# EAGLE design development board (EAGLE 6.3)
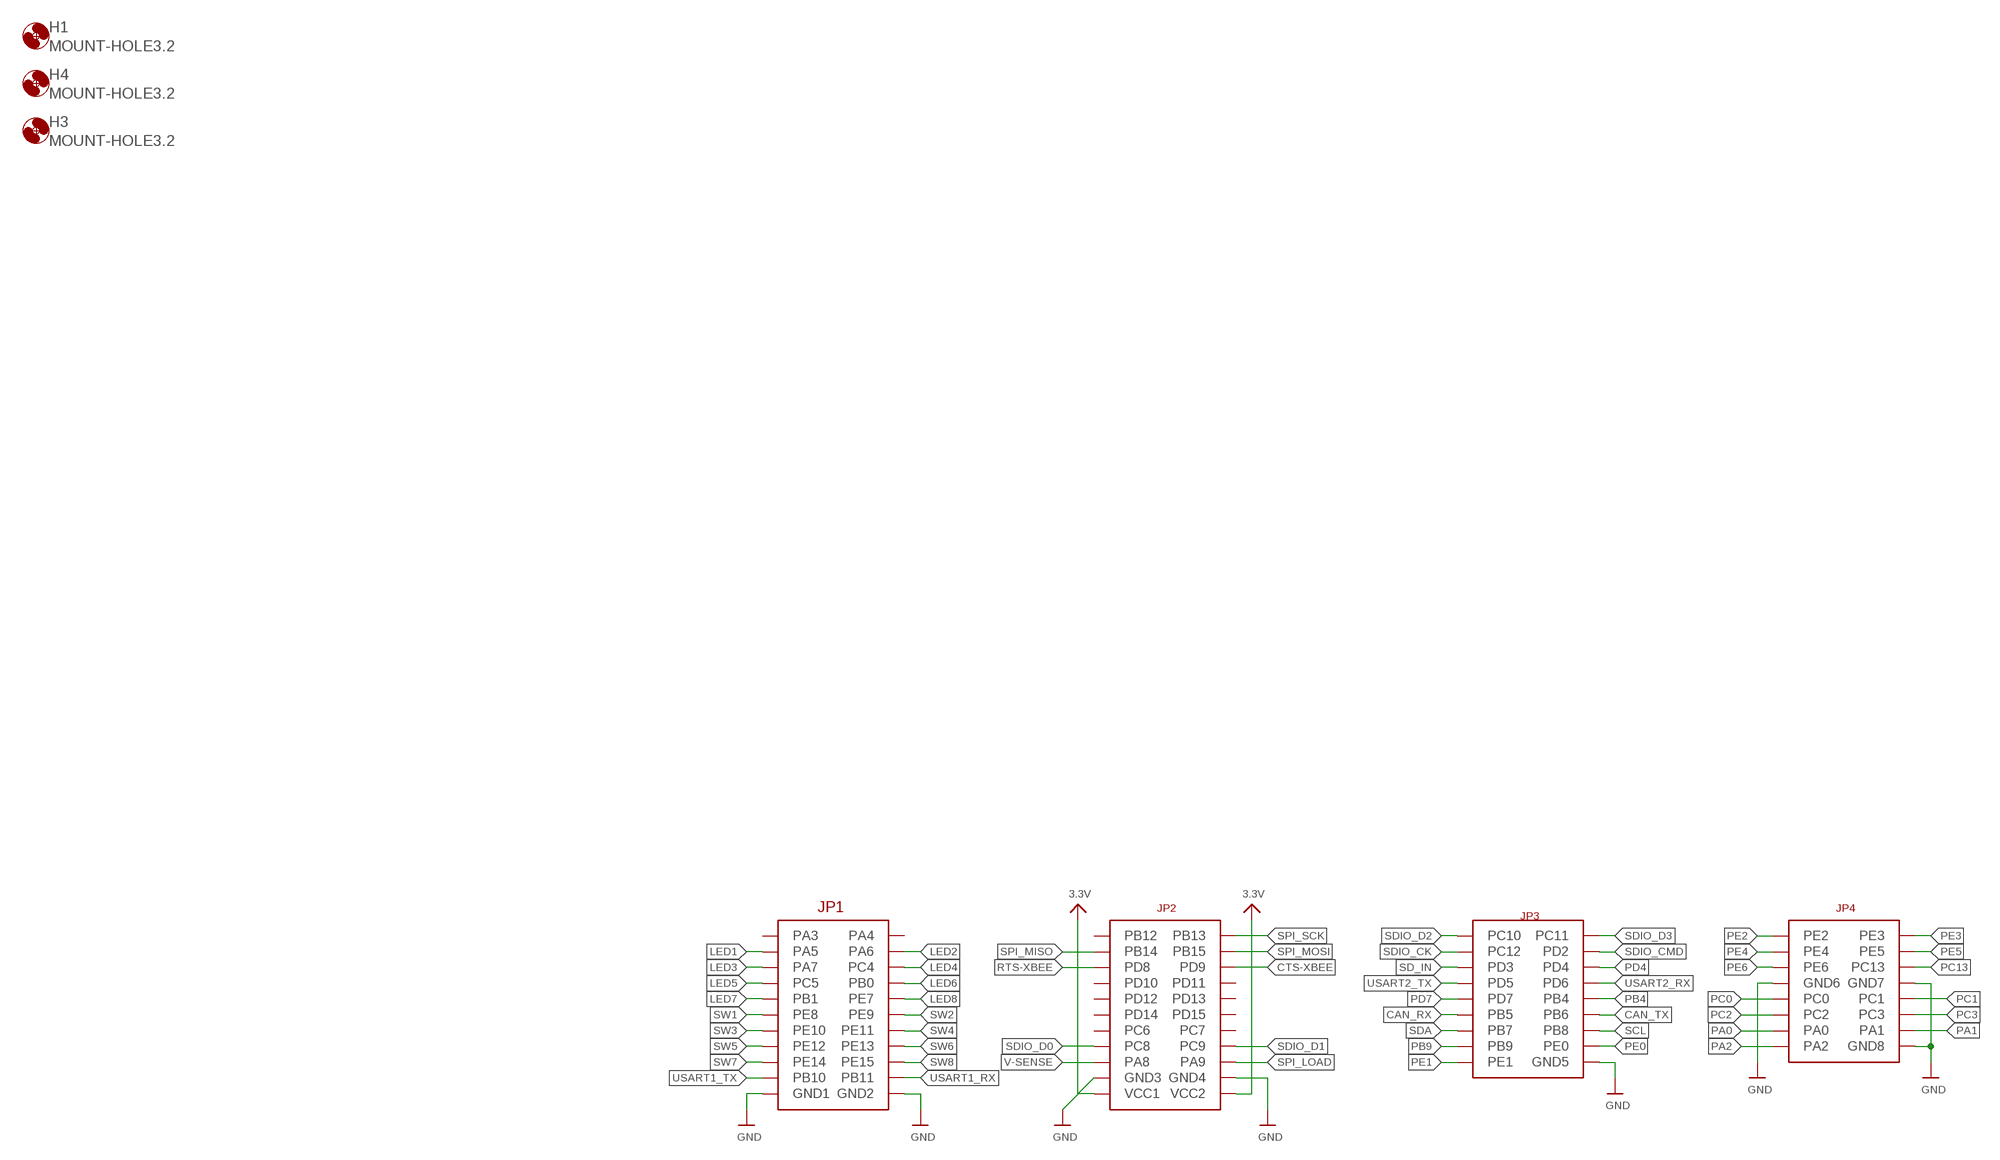
[diagram p0: schematic, sheet 1, part 1 of 3]
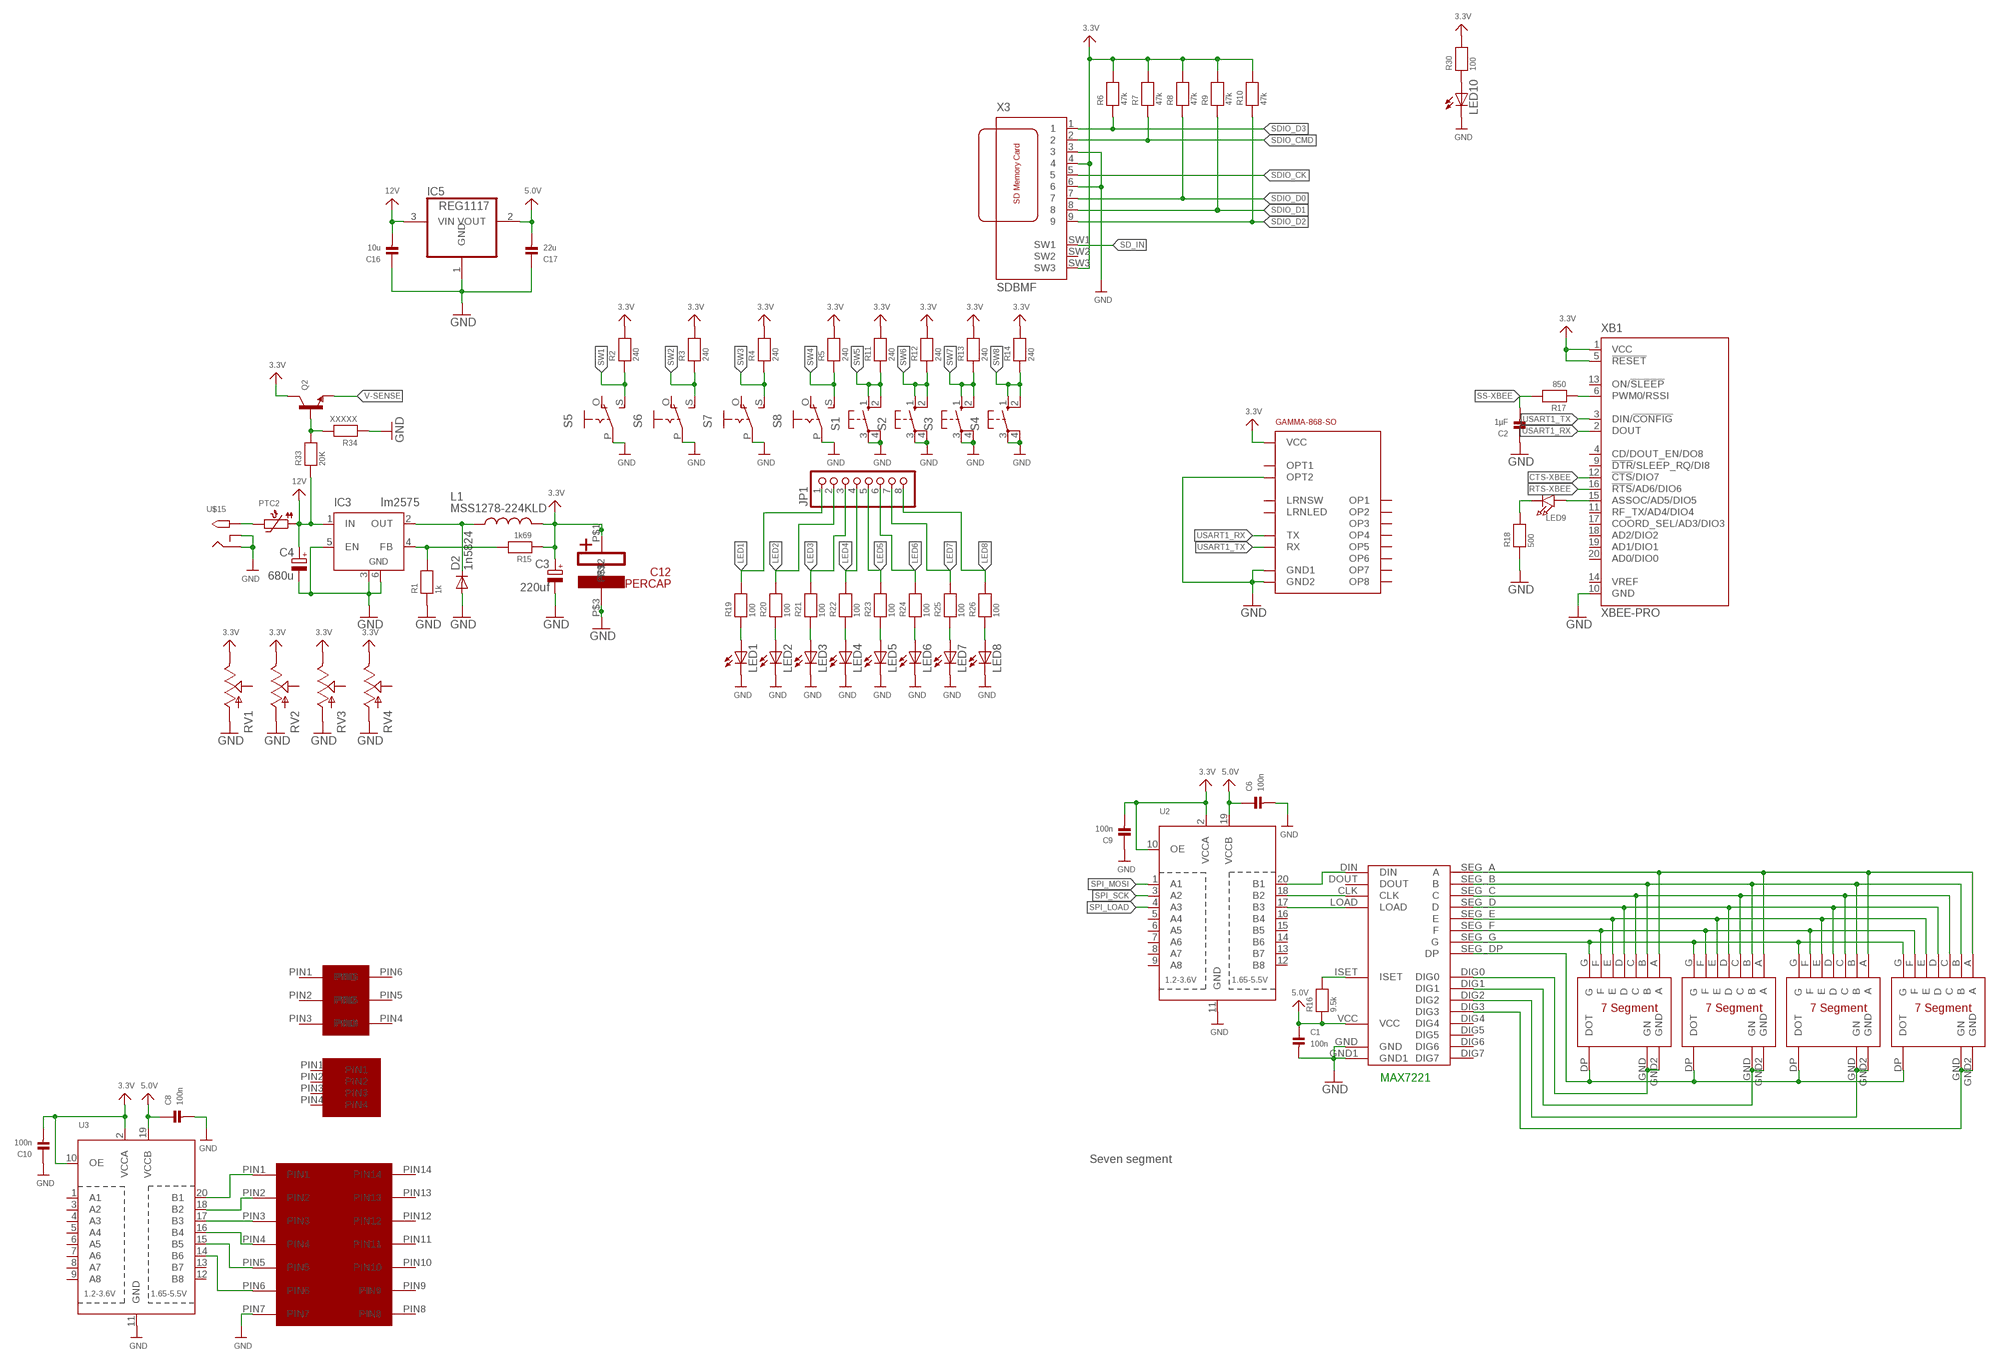
[diagram p1: schematic, sheet 1, part 2 of 3]
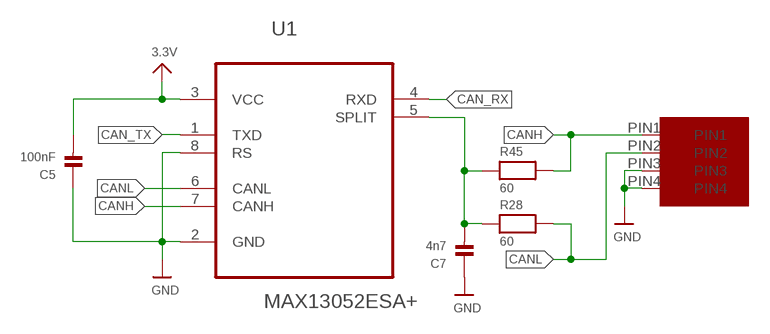
[diagram p2: schematic, sheet 1, part 3 of 3]

## Parts
C1  100n  CAP_CERAMIC_0603  [_0603]
C2  1µF  CAP_CERAMIC_0805  [_0805]
C3  220uf  CPOL-EUE3.5-8  [E3,5-8]
C4  680u  CPOL-EUE5-10.5  [E5-10,5]
C5  100nF  CAP_CERAMIC_0603  [_0603]
C6  100n  CAP_CERAMIC_0603  [_0603]
C7  4n7  CAP_CERAMIC_0603  [_0603]
C8  100n  CAP_CERAMIC_0603  [_0603]
C9  100n  CAP_CERAMIC_0603  [_0603]
C10  100n  CAP_CERAMIC_0603  [_0603]
C12  SUPERCAP  [SUPERCAP]
C16  10u  CAP_CERAMIC_0805  [_0805]
C17  22u  CAP_CERAMIC_0805  [_0805]
D2  1n5824  1N5400  [DO201-15]
H1  MOUNT-HOLE3.2  [3,2]
H3  MOUNT-HOLE3.2  [3,2]
H4  MOUNT-HOLE3.2  [3,2]
IC3  lm2575  LM2596S  [TO263-5]
IC5  REG1117  [SOT223]
JP1  PINHD-1X8BIG  [1X08-BIG]
L1  MSS1278-224KLD  INDUCTORPWR  [CDRH125]
LED1  LEDCHIPLED_1206  [CHIPLED_1206]
LED2  LEDCHIPLED_1206  [CHIPLED_1206]
LED3  LEDCHIPLED_1206  [CHIPLED_1206]
LED4  LEDCHIPLED_1206  [CHIPLED_1206]
LED5  LEDCHIPLED_1206  [CHIPLED_1206]
LED6  LEDCHIPLED_1206  [CHIPLED_1206]
LED7  LEDCHIPLED_1206  [CHIPLED_1206]
LED8  LEDCHIPLED_1206  [CHIPLED_1206]
LED9  LED1206  [CHIPLED_1206]
LED10  LEDCHIPLED_1206  [CHIPLED_1206]
MAX7221  MAX7221-SMD  [MAX7221]
PTC2  PTC1812  [PTC1812]
Q2  TRANSISTOR_NPNWIDE  [SOT23-WIDE]
R1  1k  RESISTOR_0603  [_0603]
R2  240  RESISTOR_0603  [_0603]
R3  240  RESISTOR_0603  [_0603]
R4  240  RESISTOR_0603  [_0603]
R5  240  RESISTOR_0603  [_0603]
R6  47k  RESISTOR_0603  [_0603]
R7  47k  RESISTOR_0603  [_0603]
R8  47k  RESISTOR_0603  [_0603]
R9  47k  RESISTOR_0603  [_0603]
R10  47k  RESISTOR_0603  [_0603]
R11  240  RESISTOR_0603  [_0603]
R12  240  RESISTOR_0603  [_0603]
R13  240  RESISTOR_0603  [_0603]
R14  240  RESISTOR_0603  [_0603]
R15  1k69  RESISTOR_0603  [_0603]
R16  9.5k  RESISTOR_0603  [_0603]
R17  850  RESISTOR_0603  [_0603]
R18  500  RESISTOR_0603  [_0603]
R19  100  RESISTOR_0603  [_0603]
R20  100  RESISTOR_0603  [_0603]
R21  100  RESISTOR_0603  [_0603]
R22  100  RESISTOR_0603  [_0603]
R23  100  RESISTOR_0603  [_0603]
R24  100  RESISTOR_0603  [_0603]
R25  100  RESISTOR_0603  [_0603]
R26  100  RESISTOR_0603  [_0603]
R28  60  RESISTOR_0603  [_0603]
R30  100  RESISTOR_0603  [_0603]
R33  20K  RESISTOR_0603  [_0603]
R34  XXXXX  RESISTOR_0603  [_0603]
R45  60  RESISTOR_0603  [_0603]
RV1  POT  [ALPS_POT]
RV2  POT  [ALPS_POT]
RV3  POT  [ALPS_POT]
RV4  POT  [ALPS_POT]
S1  10-XX  [B3F-10XX]
S2  10-XX  [B3F-10XX]
S3  10-XX  [B3F-10XX]
S4  10-XX  [B3F-10XX]
S5  EG1218S  [EG1218]
S6  EG1218S  [EG1218]
S7  EG1218S  [EG1218]
S8  EG1218S  [EG1218]
U1  MAX13052ESA+  [SOIC127P600X175-8N]
U2  TXB0108PWR  [TSSOP20]
U3  TXB0108PWR  [TSSOP20]
U$1  CPU-BOARD  [CPU-BOARD-JP1]
U$2  GAMMA-868-SO  [UNICORN_V2_GAMMA-868-SO]
U$15  2.1MMJACKSMT  [DCJACK_2MM_SMT]
U$23  REDSEVENSEGMENT  [REDSEGMENT]
U$24  REDSEVENSEGMENT  [REDSEGMENT]
U$25  REDSEVENSEGMENT  [REDSEGMENT]
U$26  REDSEVENSEGMENT  [REDSEGMENT]
U$57  MICROFIT4  [MICROFIT4SOCK]
U$61  MICROFIT14  [MICROFIT14SOCK]
U$67  MICROFIT4  [MICROFIT4SOCK]
U$68  MICROFIT6  [MICROFIT6SOCK]
X3  SDBMF  [SDBMF-009XXBXX2]
XB1  XBEE-PRO  [XBEE-PRO]

## Nets
3.3V: C3.+ C5.2 C9.2 C10.2 C12.P$1 L1.2 Q2.3(C) R2.2 R3.2 R4.2 R5.2 R6.2 R7.2 R8.2 R9.2 R10.2 R11.2 R12.2 R13.2 R14.2 R15.1 R30.2 RV1.P$1(E) RV2.P$1(E) RV3.P$1(E) RV4.P$1(E) U1.3(VCC) U2.2(VCCA) U2.10(OE) U3.2(VCCA) U3.10(OE) U$1.P$43(VCC1) U$1.P$44(VCC2) U$2.P$16(VCC) X3.4 X3.SW3 XB1.1(VCC) XB1.5(!RESET)
5.0V: C1.1 C6.1 C8.1 C17.2 IC5.2(VOUT) MAX7221.VCC R16.1 U2.19(VCCB) U3.19(VCCB)
12V: C4.+ C16.2 IC3.1(IN) IC5.3(VIN) PTC2.P$1 R33.1
CAN_RX: U1.4(RXD) U$1.P$55(PB5)
CAN_TX: U1.1(TXD) U$1.P$56(PB6)
CANH: R45.2 U1.7(CANH) U$57.PIN1
CANL: R28.2 U1.6(CANL) U$57.PIN2
CTS-XBEE: U$1.P$28(PD9) XB1.12(!CTS!/DIO7)
DIG0: MAX7221.DIG0 U$23.GND2(GND) U$23.GND(GN)
DIG1: MAX7221.DIG1 U$24.GND2(GND) U$24.GND(GN)
DIG2: MAX7221.DIG2 U$25.GND2(GND) U$25.GND(GN)
DIG3: MAX7221.DIG3 U$26.GND2(GND) U$26.GND(GN)
GND: C1.2 C2.1 C3.- C4.- C5.1 C6.2 C7.1 C8.2 C9.1 C10.1 C12.P$3 C16.1 C17.1 D2.A IC3.3(GND) IC3.5(EN) IC3.6(GND) IC5.1(GND) LED1.C LED2.C LED3.C LED4.C LED5.C LED6.C LED7.C LED8.C LED10.C MAX7221.GND MAX7221.GND1 R1.1 R18.1 R34.1 RV1.P$3(A) RV2.P$3(A) RV3.P$3(A) RV4.P$3(A) S1.3(P) S1.4(P1) S2.3(P) S2.4(P1) S3.3(P) S3.4(P1) S4.3(P) S4.4(P1) S5.P S6.P S7.P S8.P U1.2(GND) U1.8(RS) U2.11(GND) U3.11(GND) U$1.P$19(GND1) U$1.P$20(GND2) U$1.P$41(GND3) U$1.P$42(GND4) U$1.P$62(GND5) U$1.P$69(GND6) U$1.P$70(GND7) U$1.P$78(GND8) U$2.P$2(GND1) U$2.P$14(OPT2) U$2.P$15(GND2) U$15.GND(RING) U$15.GNDBREAK(RING_SW) U$57.PIN3 U$57.PIN4 U$61.PIN7 X3.3 X3.6 XB1.10(GND)
LED1: JP1.1 R19.2 U$1.P$3(PA5)
LED2: JP1.2 R20.2 U$1.P$4(PA6)
LED3: JP1.3 R21.2 U$1.P$5(PA7)
LED4: JP1.4 R22.2 U$1.P$6(PC4)
LED5: JP1.5 R23.2 U$1.P$7(PC5)
LED6: JP1.6 R24.2 U$1.P$8(PB0)
LED7: JP1.7 R25.2 U$1.P$9(PB1)
LED8: JP1.8 R26.2 U$1.P$10(PE7)
N$1: PTC2.P$2 U$15.PWR2(TIP)
N$2: R17.1 XB1.6(PWM0/RSSI)
N$3: U3.17(B3) U$61.PIN3
N$4: U3.16(B4) U$61.PIN4
N$5: LED9.A XB1.15(ASSOC/AD5/DIO5)
N$6: LED9.C R18.2
N$7: Q2.1(B) R33.2 R34.2
N$8: U3.18(B2) U$61.PIN2
N$9: U3.20(B1) U$61.PIN1
N$10: U3.15(B5) U$61.PIN5
N$11: U3.14(B6) U$61.PIN6
N$18: MAX7221.SEG_A(A) U$23.A U$24.A U$25.A U$26.A
N$19: IC3.4(FB) R1.2 R15.2
N$20: LED10.A R30.1
N$21: D2.C IC3.2(OUT) L1.1
N$23: MAX7221.SEG_B(B) U$23.B U$24.B U$25.B U$26.B
N$24: MAX7221.SEG_C(C) U$23.C U$24.C U$25.C U$26.C
N$25: MAX7221.SEG_D(D) U$23.D U$24.D U$25.D U$26.D
N$26: MAX7221.SEG_E(E) U$23.E U$24.E U$25.E U$26.E
N$27: MAX7221.SEG_F(F) U$23.F U$24.F U$25.F U$26.F
N$28: MAX7221.SEG_G(G) U$23.G U$24.G U$25.G U$26.G
N$30: LED1.A R19.1
N$32: LED2.A R20.1
N$34: LED3.A R21.1
N$36: LED4.A R22.1
N$38: LED5.A R23.1
N$40: LED6.A R24.1
N$42: LED7.A R25.1
N$44: LED8.A R26.1
N$54: MAX7221.SEG_DP(DP) U$23.DP(DOT) U$24.DP(DOT) U$25.DP(DOT) U$26.DP(DOT)
N$55: MAX7221.ISET R16.2
N$56: MAX7221.CLK U2.18(B2)
N$57: MAX7221.LOAD U2.17(B3)
N$58: MAX7221.DIN U2.20(B1)
N$72: C7.2 R28.1 R45.1 U1.5(SPLIT)
PA0: U$1.P$75(PA0)
PA1: U$1.P$76(PA1)
PA2: U$1.P$77(PA2)
PB4: U$1.P$54(PB4)
PB9: U$1.P$59(PB9)
PC0: U$1.P$71(PC0)
PC1: U$1.P$72(PC1)
PC2: U$1.P$73(PC2)
PC3: U$1.P$74(PC3)
PC13: U$1.P$68(PC13)
PD4: U$1.P$50(PD4)
PD7: U$1.P$53(PD7)
PE0: U$1.P$60(PE0)
PE1: U$1.P$61(PE1)
PE2: U$1.P$63(PE2)
PE3: U$1.P$64(PE3)
PE4: U$1.P$65(PE4)
PE5: U$1.P$66(PE5)
PE6: U$1.P$67(PE6)
RTS-XBEE: U$1.P$27(PD8) XB1.16(!RTS!/AD6/DIO6)
SCL: U$1.P$58(PB8)
SD_IN: U$1.P$49(PD3) X3.SW1
SDA: U$1.P$57(PB7)
SDIO_CK: U$1.P$47(PC12) X3.5
SDIO_CMD: R7.1 U$1.P$48(PD2) X3.2
SDIO_D0: R8.1 U$1.P$37(PC8) X3.7
SDIO_D1: R9.1 U$1.P$38(PC9) X3.8
SDIO_D2: R10.1 U$1.P$45(PC10) X3.9
SDIO_D3: R6.1 U$1.P$46(PC11) X3.1
SPI_LOAD: U2.4(A3) U$1.P$40(PA9)
SPI_MISO: U$1.P$25(PB14)
SPI_MOSI: U2.1(A1) U$1.P$26(PB15)
SPI_SCK: U2.3(A2) U$1.P$24(PB13)
SS-XBEE: C2.2 R17.2
SW1: R2.1 S5.S U$1.P$11(PE8)
SW2: R3.1 S6.S U$1.P$12(PE9)
SW3: R4.1 S7.S U$1.P$13(PE10)
SW4: R5.1 S8.S U$1.P$14(PE11)
SW5: R11.1 S1.1(S) S1.2(S1) U$1.P$15(PE12)
SW6: R12.1 S2.1(S) S2.2(S1) U$1.P$16(PE13)
SW7: R13.1 S3.1(S) S3.2(S1) U$1.P$17(PE14)
SW8: R14.1 S4.1(S) S4.2(S1) U$1.P$18(PE15)
USART1_RX: U$1.P$22(PB11) U$2.P$17(TX) XB1.2(DOUT)
USART1_TX: U$1.P$21(PB10) U$2.P$18(RX) XB1.3(DIN/!CONFIG)
USART2_RX: U$1.P$52(PD6)
USART2_TX: U$1.P$51(PD5)
V-SENSE: Q2.2(E) U$1.P$39(PA8)
Unconnected: MAX7221.DIG4 MAX7221.DIG5 MAX7221.DIG6 MAX7221.DIG7 MAX7221.DOUT RV1.P$2(S) RV2.P$2(S) RV3.P$2(S) RV4.P$2(S) S5.O S6.O S7.O S8.O U2.5(A4) U2.6(A5) U2.7(A6) U2.8(A7) U2.9(A8) U2.12(B8) U2.13(B7) U2.14(B6) U2.15(B5) U2.16(B4) U3.1(A1) U3.3(A2) U3.4(A3) U3.5(A4) U3.6(A5) U3.7(A6) U3.8(A7) U3.9(A8) U3.12(B8) U3.13(B7) U$1.P$1(PA3) U$1.P$2(PA4) U$1.P$23(PB12) U$1.P$29(PD10) U$1.P$30(PD11) U$1.P$31(PD12) U$1.P$32(PD13) U$1.P$33(PD14) U$1.P$34(PD15) U$1.P$35(PC6) U$1.P$36(PC7) U$2.P$3(OP1) U$2.P$4(OP2) U$2.P$5(LRNSW) U$2.P$6(LRNLED) U$2.P$7(OP3) U$2.P$8(OP4) U$2.P$9(OP5) U$2.P$10(OPT1) U$2.P$11(OP6) U$2.P$12(OP7) U$2.P$13(OP8) U$61.PIN8 U$61.PIN9 U$61.PIN10 U$61.PIN11 U$61.PIN12 U$61.PIN13 U$61.PIN14 U$67.PIN1 U$67.PIN2 U$67.PIN3 U$67.PIN4 U$68.PIN1 U$68.PIN2 U$68.PIN3 U$68.PIN4 U$68.PIN5 U$68.PIN6 X3.SW2 XB1.4(CD/DOUT_EN/DO8) XB1.9(!DTR!/SLEEP_RQ/DI8) XB1.11(RF_TX/AD4/DIO4) XB1.13(ON/!SLEEP) XB1.14(VREF) XB1.17(COORD_SEL/AD3/DIO3) XB1.18(AD2/DIO2) XB1.19(AD1/DIO1) XB1.20(AD0/DIO0)

## Notes on the sheet
- MAX7221
- Seven segment

## Library data of the parts
C1 C2 C5-C10 C16 C17 = microbuilder:CAP_CERAMIC: Ceramic Capacitors 0402 - 0402 Surface Mount Capacitors 16pF 50V 5% [Digikey: 445-4899-2-ND] 18pF 50V 5% [Digikey: 490-1281-2-ND] 22pF 50V 5% [Digikey: 490-1283-2-ND] 68pF 50V 5% [Digikey: 490-1289-2-ND] 0.1uF 10V 10% [Digikey: 490-1318-2-ND] 1.0uF 6.3V 10% [Digikey: 490-1320-2-ND] 0603 - 0603 Surface Mount Capacitors 16 pF 50V 5% [Digikey: 445-5051-2-ND] 22 pF 50V [Digikey: PCC220ACVTR-ND] 33 pF 50V 5% [Digikey: 490-1415-1-ND] 56pF 50V 5% [Digikey: 490-1421-1-ND] 220pF 50V 5% [Digikey: 445-1285-1-ND] 680 pF 50V 2200 pF 50V 5% C0G [Digikey: 445-1297-1-ND] 5600 pF 100V 5% X7R [Digikey: 478-3711-1-ND] 0.1 µF 25V 10% [Digikey: PCC2277TR-ND] 0.22 µF 16V 10% X7R [Digikey: 445-1318-1-ND] 1.0 µF 25V 10% [Digikey: 445-5146-2-ND] 0603 - RF Specific 3pF 250V +/-0.1pF RF [Digikey: 712-1347-1-ND] 18 pF 250V 5% [Digikey: 478-3505-1-ND or 712-1322-1-ND] 56 pF 250V 5% C0G RF [Digikey: 490-4867-1-ND] 68 pF 250V RF [Digikey: 490-4868-1-ND] 0805 - 0805 Surface Mount Capacitors 220 pF 250V 2% RF Ceramic Capacitor [Digikey: 712-1398-1-ND] 1000 pF 50V 2% NP0 Ceramic Capacitor [Digikey: 478-3760-1-ND] 0.1 µF 25V 10% Ceramic Capacitor [Digikey: PCC1828TR-ND] 1.0 µF 16V 10% Ceramic Capacitor[Digikey: 490-1691-2-ND] 10.0 µF 10V 10% Ceramic Capacitor[Digikey: 709-1228-1-ND] 10.0 uF 16V 10% Ceramic Capacitor [Digikey: 478-5165-2-ND] 47 uF 6.3V 20% Ceramic Capacitor [Digikey: 587-1779-1-ND or 399-5506-1-ND] 1206 - 1206 Surface Mount Capacitors 47uF 10V 20% Ceramic Capacitor [Digikey: 490-5528-1-ND or 399-5508-1-ND or 445-6010-1-ND] 100uF 6.3V -20%, +80% Y5V Ceramic Capacitor (Digikey: 490-4512-1-ND, Mouser: 81-GRM31CF50J107ZE1L)
C3 C4 = rcl:CPOL-EU: POLARIZED CAPACITOR, European symbol
C12 = unicorn_v2:SUPERCAP
D2 = diode:1N5400: DIODE standard rectifier, 3 A, 50 V (Motorola)
H1 H3 H4 = holes:MOUNT-HOLE: MOUNTING HOLE with drill center marker
IC3 = linear:LM2596S: STEP-DOWN VOLTAGE REGULATOR
IC5 = burr-brown:REG1117: 800mA and 1A Low Dropout (LDO) Positive Regulator 1.8V, 2.5V, 2.85V, 3.3V, 5V, and Adj; MPN: REG1117; OC_FARNELL: 1097566; OC_NEWARK: 14P6981
JP1 = adafruit:PINHD-1X8: PIN HEADER
L1 = SparkFun-Passives:INDUCTOR: Inductors Basic Inductor/Choke - 0603 and 1206. Footprints are not proven and vary greatly between part numbers. INDUCTOR POWER 3.3UH 4.0A SMD 0.197" L x 0.197" W x 0.177" H (5.00mm x 5.00mm x 4.50mm)
LED1-LED8 LED10 = adafruit:LED: LED
LED9 = microbuilder:LED: LED
MAX7221 = max7221-smd:MAX7221-SMD
PTC2 = microbuilder:PTC: PTC (Resettable Fuse) 1206 Package 250mA PTC (16V Max, Time-to-Trip: 0.08s) - Digikey: F2110CT-ND 1210 Package 100mA PTC (30V Max, Time-to-Trip: 0.6s) - Digikey: MF-USMF010-2CT-ND 1812 Package 750mA PTC (24V Max, Time-to-Trip: 0.2s) - Digikey: MF-MSMF075/24-2CT-ND
Q2 = microbuilder:TRANSISTOR_NPN: NPN Transistor Transistor (NPN) 500mA 45V - BC817 [Digikey: 568-1631-1-ND] Transistor (NPN) 500mA 45V - BC817,215 [Mouser: 771-BC817-T/R] SOT23-R - SOT23 footprint optimised for use with solder paste and reflow ovens. SOT23-W - SOT23 footprint optimised for hand-soldering (larger pads).
R1-R26 R28 R30 R33 R34 R45 = microbuilder:RESISTOR: Resistors 0402 - 0402 Surface Mount Package 22 Ohm 1% 1/16W [Digikey: 311-22.0LRTR-ND] 33 Ohm 5% 1/16W 1.0K 5% 1/16W 1.5K 5% 1/16W 2.0K 1% 1/16W 10.0K 1% 1/16W [Digikey: 311-10.0KLRTR-ND] 10.0K 5% 1/16W [Digikey: RMCF0402JT10K0TR-ND] 12.1K 1% 1/16W [Digikey: 311-22.0LRTR-ND] 100.0K 5% 1/16W 0603 - 0603 Surface Mount Package 0 Ohm 1/10 Watt 1% Resistor 15 Ohm 1/10 Watt 1% Resistor 33 Ohm 1/10 Watt 1% Resistor 49.9 Ohm 1/10 Watt 1% Resistor 100 Ohm 1/10 Watt 1% Resistor 150 Ohm 1/10 Watt 1% Resistor 240 Ohm 1/10 Watt 1% Resistor 390 Ohm 1/10 Watt 1% Resistor 560 Ohm 1/10 Watt 1% Resistor 680 Ohm 1/10 Watt 1% Resistor 750 Ohm 1/10 Watt 1% Resistor 1.0K Ohm 1/10 Watt 1% Resistor 1.5K Ohm 1/10 Watt 1% Resistor 2.0K Ohm 1/10 Watt 1% Resistor 2.2K Ohm 1/10 Watt 1% Resistor 3.3K Ohm 1/10 Watt 1% Resistor 4.7K Ohm 1/10 Watt 1% Resistor 10.0K Ohm 1/10 Watt 1% Resistor 12.0K Ohm 1/10 Watt 1% Resistor 12.1K Ohm 1/10 Watt 1% Resistor 20.0K Ohm 1/10 Watt 1% Resistor 33.0K Ohm 1/10 Watt 1% Resistor 100.0K Ohm 1/10 Watt 1% Resistor 0805 - 0805 Surface Mount Package 0 Ohm 1/8 Watt 1% Resistor 33 Ohm 1/8 Watt 1% Resistor 100 Ohm 1/8 Watt 1% Resistor 150 Ohm 1/8 Watt 1% Resistor 200 Ohm 1/8 Watt 1% Resistor 240 Ohm 1/8 Watt 1% Resistor 330 Ohm 1/8 Watt 1% Resistor 390 Ohm 1/8 Watt 1% Resistor 470 Ohm 1/8 Watt 1% Resistor 1.0K Ohm 1/8 Watt 1% Resistor 1.5K Ohm 1/8 Watt 1% Resistor 2.0K Ohm 1/8 Watt 1% Resistor 4.7K Ohm 1/8 Watt 1% Resistor 5.1K Ohm 1/8 Watt 1% Resistor 5.6K Ohm 1/8 Watt 1% Resistor 10.0K Ohm 1/8 Watt 1% Resistor 22.0K Ohm 1/8 Watt 1% Resistor 33.0K Ohm 1/8 Watt 1% Resistor 100K Ohm 1/8 Watt 1% Resistor 1206 - 1206 Surface Mount Package 2012 - 2010 Surface Mount Package 0.11 Ohm 1/2 Watt 1% Resistor - Digikey: RHM.11UCT-ND
RV1-RV4 = SparkFun-Electromechanical:POT; PROD_ID: RES-09177
S1-S4 = switch-omron:10-XX: OMRON SWITCH; MPN: B3F-1000; OC_FARNELL: 176432; OC_NEWARK: 36M3542
S5-S8 = adafruit:EG1218: SLIDING SWITCH 0.1" spacing through hole, vertical SPDT slide switch http://www.ladyada.net/library/pcb/eaglelibrary.html
U1 = Maxim_By_element14_Batch_1:MAX13052ESA+: Industry-Standard High-Speed CAN Transceivers with ±80V Fault Protection; MPN: MAX13052ESA+; OC_FARNELL: 1600112; OC_NEWARK: 99K2875; PACKAGE: SOIC-8; SUPPLIER: Maxim
U2 U3 = microbuilder:TXB0108PWR: 8-Bit Bi-Directional Level Shifter 1.2V-3.6V (VCCA) to 1.65V-5.5V (VCCB) bi-directional level shifter with auto direction sensing. Max data rate - VCCA 1.8V: 20Mbps (50ns), VCCA 3.3V: 100Mbps (10ns) Digikey: 296-21527-1-ND
U$1 = unicorn_v2:CPU-BOARD
U$2 = unicorn_v2:GAMMA-868-SO
U$15 = adafruit:2.1MMJACK: 2.1mm x 5.5mm THM DC jack with internal switch. Digikey part #PJ-102A, 4UCON part #05537 2.1mm x 5.5mm SMT DC jack with internal switch. Digikey part #PJ-002A-SMT, 4UCON part #03267 By microbuilder.eu & adafruit.com
U$23-U$26 = red_segment:REDSEVENSEGMENT
U$57 U$67 = unicorn:MICROFIT4
U$61 = unicorn:MICROFIT14
U$68 = unicorn:MICROFIT6
X3 = farnell:SDBMF: SD MEMORY CARD PUSH-PUSH WITH CONNECTOR TYPE B (BIG SWUÌTCH #3) KINGFONT PRECISION INDUSTIAL CO., LTD Source: http://www.farnell.com/datasheets/74273.pdf Best.-Nr.: 9186174 Hersteller: MULTICOMP Herstellerbez.: SDBMF-00915B0T2
XB1 = maxstream:XBEE: XBee (TM) /XBee-PRO(TM) OEM RF Modules Source: MaxStream, Inc. xbee_productmanual.pdf; MPN: XBP24-AWI-001; OC_FARNELL: 1337916; OC_NEWARK: 42M2667

## Board
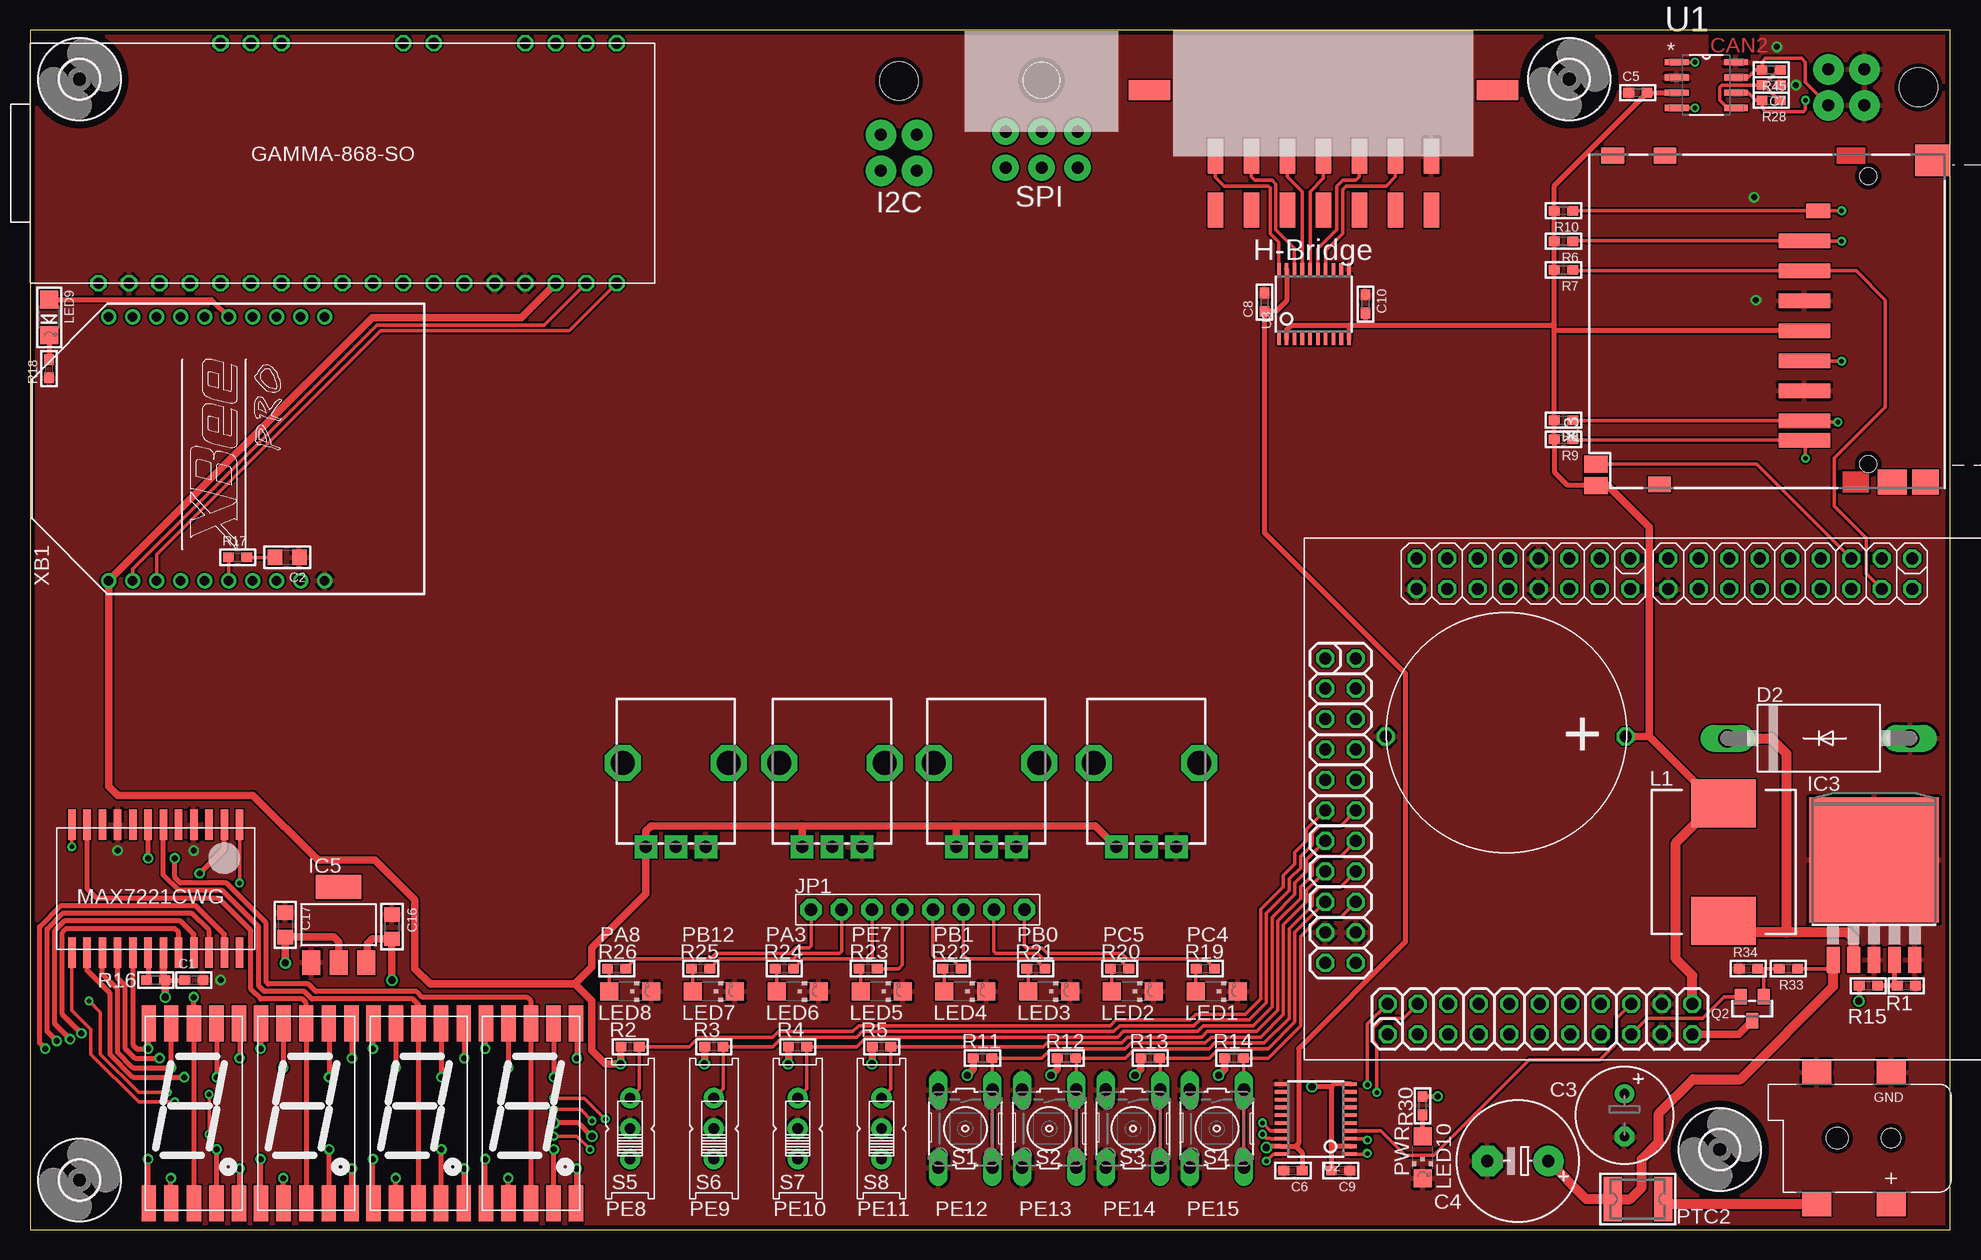
[diagram p3: board, top side]
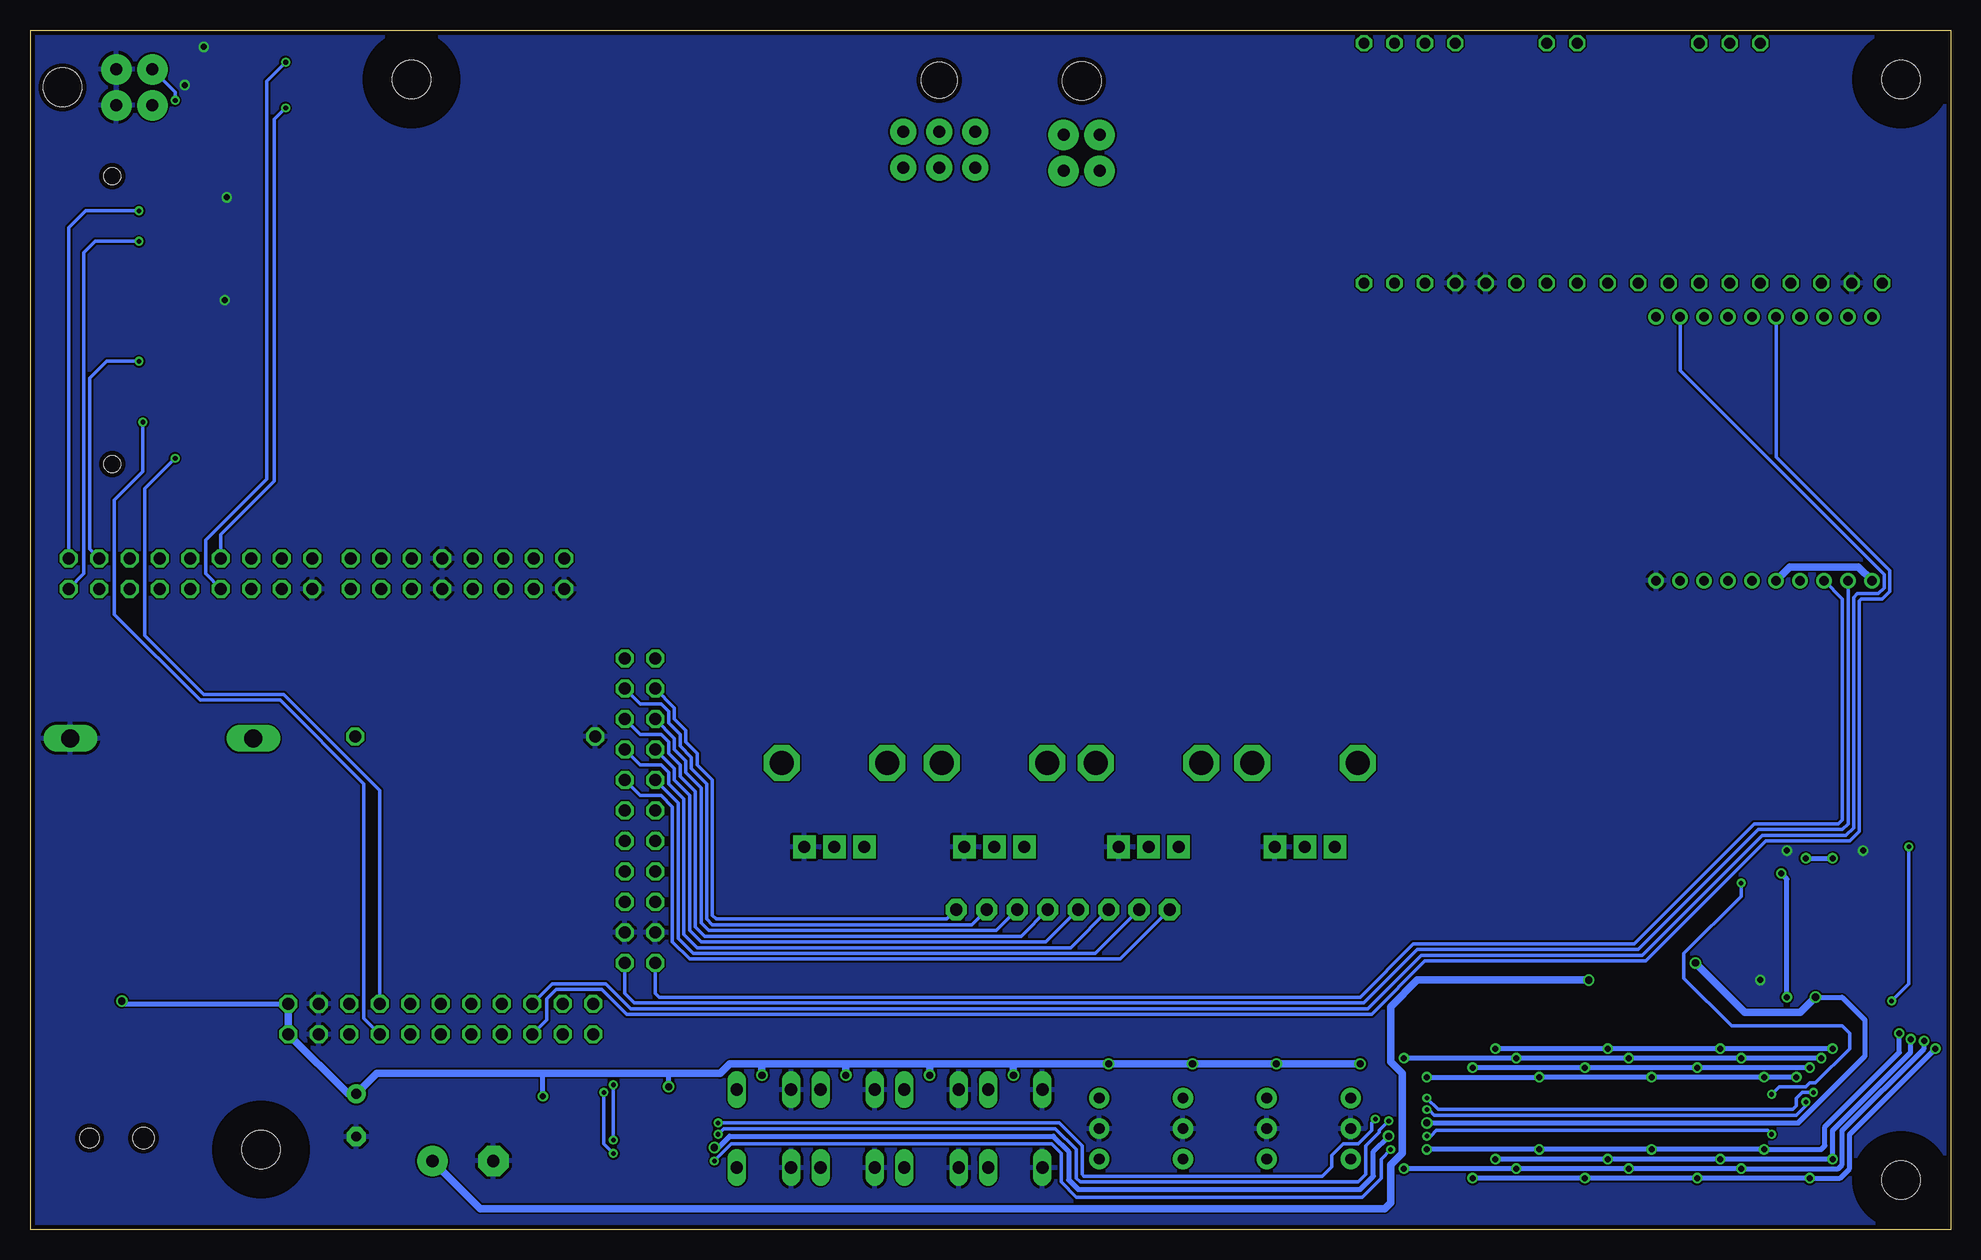
[diagram p4: board, bottom side, seen from below]

Size 160 x 100 mm. Coordinates in mm from the lower left corner, seen from the top.
Outline: 0,0 160,0 160,100 0,100 0,0
Copper layers (1*16): Top 0.0356mm / dielectric 1.5011mm / Bottom 0.0356mm
Design rules "LaenPCBOrder": minimum track width 6mil, minimum drill 13mil, track to track 6mil, track to pad 6mil, pad to pad 6mil, via to via 6mil, smd to smd 6mil, copper to edge 15mil, drill to drill 6mil, minimum pad ring 7mil, minimum via ring 7mil, stop-mask expansion 3mil, vias tented up to drill 0mil, thermal gap 10mil

### Footprints (pad centres in the part's own frame; a part is rotated, then mirrored left to right if it is on the bottom)
_0603 = smd 0.9 x 0.8: 1 -0.762,0; 2 0.762,0
_0805 = smd 1.2 x 1.3: 1 -1.016,0; 2 1.016,0
E3,5-8 = drill 0.813 pad 1.6: + -1.778,0 | drill 0.813 pad 1.6 octagon: - 1.778,0
E5-10,5 = drill 1.016 pad 2.54: + -2.54,0 | drill 1.016 pad 2.54 octagon: - 2.54,0
SUPERCAP = drill 1 octagon: P$1 -9.93,0.35; P$3 10.07,0.35
DO201-15 = drill 1.499 long: A 7.62,0; C -7.62,0
3,2 = hole 3.2: 0,0
TO263-5 = smd 1.067 x 2.159: 1 -3.404,-5.791; 2 -1.702,-5.791; 3 0,-5.791; 4 1.702,-5.791; 5 3.404,-5.791 | smd 10.8 x 10.41: 6 0,2.54
SOT223 = smd 1.499 x 2.007: 1 -2.261,-3.15; 2 0.025,-3.15; 3 2.311,-3.15 | smd 3.81 x 2.007: 4 0,3.15
1X08-BIG = drill 1.016 pad 1.778 octagon: 1 -8.89,0; 2 -6.35,0; 3 -3.81,0; 4 -1.27,0; 5 1.27,0; 6 3.81,0; 7 6.35,0; 8 8.89,0
CDRH125 = smd 5.4 x 4: 1 0,4.9; 2 0,-4.9
CHIPLED_1206 = smd 1.5 x 1.5: A 0,-1.75; C 0,1.75
CHIPLED_1206' = smd 1.5 x 1.5: A 0,-1.496; C 0,1.496
MAX7221 = smd 0.635 x 2.54: CLK 7.62,5.325; DIG0 -5.08,-5.325; DIG1 6.35,-5.325; DIG2 0,-5.325; DIG3 1.27,-5.325; DIG4 -3.81,-5.325; DIG5 5.08,-5.325; DIG6 -1.27,-5.325; DIG7 2.54,-5.325; DIN -6.35,-5.325; DOUT -6.35,5.325; GND -2.54,-5.325; GND1 3.81,-5.325; ISET 1.27,5.325; LOAD 7.62,-5.325; SEG_A 6.35,5.325; SEG_B 3.81,5.325; SEG_C -1.27,5.325; SEG_D -5.08,5.325; SEG_DP -3.81,5.325; SEG_E -2.54,5.325; SEG_F 5.08,5.325; SEG_G 2.54,5.325; VCC 0,5.325
PTC1812 = smd 1.5 x 3.7: P$1 -2.1,0; P$2 2.1,0
SOT23-WIDE = smd 1 x 1.27: 1 -0.95,-1; 2 0.95,-1; 3 0,1
ALPS_POT = drill 1 pad 1.88 square: P$1 7,-2.5; P$2 7,0; P$3 7,2.5 | drill 2 octagon: P$4 0,-4.4; P$5 0,4.4
B3F-10XX = drill 1.016 long: 1 -3.251,2.261; 2 3.251,2.261; 3 -3.251,-2.261; 4 3.251,-2.261
EG1218 = drill 0.9 pad 1.676: O -2.54,0; P 0,0; S 2.54,0
SOIC127P600X175-8N = smd 1.981 x 0.533: 1 -2.464,1.905; 2 -2.464,0.635; 3 -2.464,-0.635; 4 -2.464,-1.905; 5 2.464,-1.905; 6 2.464,-0.635; 7 2.464,0.635; 8 2.464,1.905
TSSOP20 = smd 0.305 x 0.991: 1 -2.925,-2.918; 2 -2.275,-2.918; 3 -1.625,-2.918; 4 -0.975,-2.918; 5 -0.325,-2.918; 6 0.325,-2.918; 7 0.975,-2.918; 8 1.625,-2.918; 9 2.275,-2.918; 10 2.925,-2.918; 11 2.925,2.918; 12 2.275,2.918; 13 1.625,2.918; 14 0.975,2.918; 15 0.325,2.918; 16 -0.325,2.918; 17 -0.975,2.918; 18 -1.625,2.918; 19 -2.275,2.918; 20 -2.925,2.918
CPU-BOARD-JP1 = drill 1 octagon: P$1 1.27,-12.7; P$2 -1.27,-12.7; P$3 1.27,-10.16; P$4 -1.27,-10.16; P$5 1.27,-7.62; P$6 -1.27,-7.62; P$7 1.27,-5.08; P$8 -1.27,-5.08; P$9 1.27,-2.54; P$10 -1.27,-2.54; P$11 1.27,0; P$12 -1.27,0; P$13 1.27,2.54; P$14 -1.27,2.54; P$15 1.27,5.08; P$16 -1.27,5.08; P$17 1.27,7.62; P$18 -1.27,7.62; P$19 1.27,10.16; P$20 -1.27,10.16; P$21 1.27,12.7; P$22 -1.27,12.7; P$23 -3.905,18.637; P$24 -3.905,16.097; P$25 -6.445,18.637; P$26 -6.445,16.097; P$27 -8.985,18.637; P$28 -8.985,16.097; P$29 -11.525,18.637; P$30 -11.525,16.097; P$31 -14.065,18.637; P$32 -14.065,16.097; P$33 -16.605,18.637; P$34 -16.605,16.097; P$35 -19.145,18.637; P$36 -19.145,16.097; P$37 -21.685,18.637; P$38 -21.685,16.097; P$39 -24.225,18.637; P$40 -24.225,16.097; P$41 -26.765,18.637; P$42 -26.765,16.097; P$43 -29.305,18.637; P$44 -29.305,16.097; P$45 -47.625,-21.018; P$46 -47.625,-18.479; P$47 -45.085,-21.018; P$48 -45.085,-18.479; P$49 -42.545,-21.018; P$50 -42.545,-18.479; P$51 -40.005,-21.018; P$52 -40.005,-18.479; P$53 -37.465,-21.018; P$54 -37.465,-18.479; P$55 -34.925,-21.018; P$56 -34.925,-18.479; P$57 -32.385,-21.018; P$58 -32.385,-18.479; P$59 -29.845,-21.018; P$60 -29.845,-18.479; P$61 -27.305,-21.018; P$62 -27.305,-18.479; P$63 -24.115,-21.024; P$64 -24.115,-18.484; P$65 -21.575,-21.024; P$66 -21.575,-18.484; P$67 -19.035,-21.024; P$68 -19.035,-18.484; P$69 -16.495,-21.024; P$70 -16.495,-18.484; P$71 -13.955,-21.024; P$72 -13.955,-18.484; P$73 -11.415,-21.024; P$74 -11.415,-18.484; P$75 -8.875,-21.024; P$76 -8.875,-18.484; P$77 -6.335,-21.024; P$78 -6.335,-18.484
UNICORN_V2_GAMMA-868-SO = drill 0.9 octagon: P$1 0,0; P$2 2.54,0; P$3 5.08,0; P$4 7.62,0; P$5 10.16,0; P$6 12.7,0; P$7 15.24,0; P$8 17.78,0; P$9 20.32,0; P$10 22.86,0; P$11 25.4,0; P$12 27.94,0; P$13 30.48,0; P$14 33.02,0; P$15 35.56,0; P$16 38.1,0; P$17 40.64,0; P$18 43.18,0; P$19 43.18,20.003; P$20 40.64,20.003; P$21 38.1,20.003; P$22 35.56,20.003; P$23 27.94,20.003; P$24 25.4,20.003; P$25 15.24,20.003; P$26 12.7,20.003; P$27 10.16,20.003
DCJACK_2MM_SMT = smd 2.4 x 2: GND 0,-5.5; GNDBREAK 6.2,-5.5; PWR1 0,5.5; PWR2 6.2,5.5 | hole 1.6: 0,0 | hole 1.8: 4.5,0
REDSEGMENT = smd 1.2 x 3: A 1.88,7.5; B 3.76,7.5; C 1.88,-7.5; D -1.88,-7.5; DP 3.76,-7.5; E -3.76,-7.5; F -1.88,7.5; G -3.76,7.5; GND 0,-7.5; GND2 0,7.5
MICROFIT4SOCK = drill 1 pad 2.54: PIN1 -2,0; PIN2 1,0; PIN3 -2,-3; PIN4 1,-3 | hole 3.2: -0.5,-7.5
MICROFIT14SOCK = smd 3.43 x 1.65: P$15 -14.5,-7.5; P$16 14.5,-7.5 | smd 1.27 x 2.92: PIN1 9,-2; PIN2 6,-2; PIN3 3,-2; PIN4 0,-2; PIN5 -3,-2; PIN6 -6,-2; PIN7 -9,-2; PIN8 9,2.5; PIN9 6,2.5; PIN10 3,2.5; PIN11 0,2.5; PIN12 -3,2.5; PIN13 -6,2.5; PIN14 -9,2.5
MICROFIT6SOCK = drill 1 pad 2.184: PIN1 3,-1.5; PIN2 3,1.5; PIN3 0,-1.5; PIN4 0,1.5; PIN5 -3,-1.5; PIN6 -3,1.5 | hole 3: 0,-5.8
SDBMF-009XXBXX2 = smd 1.2 x 4.3: 1 6.7,5.325; 2 4.2,5.325; 3 1.7,5.325; 4 -0.8,5.325; 5 -3.3,5.325; 6 -5.8,5.325; 7 -8.3,5.325; 8 -9.925,5.325 | smd 1.2 x 2: 9 9.2,4.175 | smd 2.1 x 2.4: M1 -13.4,-2 | smd 2.6 x 2.9: M2 13.4,-5.35 | smd 1.3 x 1.9: M3 -13.6,17.4; M4 13.8,16.95; M5 13.8,21.3 | smd 1.4 x 1.95: SW1 -11.9,22.7; SW3 -13.7,22.7 | smd 2.1 x 2.2: SW2 -13.4,-4.75 | hole 1.4: -11.9,0; 12.1,0
XBEE-PRO = drill 0.8 pad 1.27: 1 -11,9; 2 -11,7; 3 -11,5; 4 -11,3; 5 -11,1; 6 -11,-1; 7 -11,-3; 8 -11,-5; 9 -11,-7; 10 -11,-9; 11 11,-9; 12 11,-7; 13 11,-5; 14 11,-3; 15 11,-1; 16 11,1; 17 11,3; 18 11,5; 19 11,7; 20 11,9

### Placement (x,y rotation side)
C1  13.65,20.8 0 top
C2  21.43,56.04 180 top
C3  132.87,9.53 270 top
C4  123.98,5.71 180 top
C5  133.99,94.77 0 top
C6  105.25,4.92 180 top
C7  145.1,95.41 180 top
C8  102.87,77.31 90 top
C9  109.22,4.92 180 top
C10  111.28,77.15 270 top
C12  123.03,41.43 180 top
C16  30.16,25.24 270 top
C17  21.27,25.4 270 top
D2  149.07,40.96 0 top
H1  4.13,95.89 0 top
H2  MOUNT-HOLE3.2  [3,2]  4.13,4.13 0 top
H3  128.27,95.89 0 top
H4  140.81,6.67 0 top
IC3  153.67,28.26 0 top
IC5  25.72,25.4 0 top
JP1  73.98,26.67 180 top
L1  141.13,30.64 180 top
LED1  98.9,19.84 270 top
LED2  91.92,19.84 270 top
LED3  84.93,19.84 270 top
LED4  77.95,19.84 270 top
LED5  70.96,19.84 270 top
LED6  63.98,19.84 270 top
LED7  56.99,19.84 270 top
LED8  50.01,19.84 270 top
LED9  [CHIPLED_1206']  1.59,76.04 180 top
LED10  116.05,6.03 180 top
MAX7221  11.11,28.42 180 top
PTC2  133.99,2.54 0 top
Q2  143.51,18.41 180 top
R1  156.37,20.32 180 top
R2  50.01,15.24 180 top
R3  56.99,15.24 180 top
R4  63.98,15.24 180 top
R5  70.96,15.24 180 top
R6  127.79,82.39 180 top
R7  127.79,80.01 180 top
R8  127.79,67.47 180 top
R9  127.79,65.88 180 top
R10  127.79,84.93 180 top
R11  79.38,14.29 180 top
R12  86.36,14.29 180 top
R13  93.34,14.29 180 top
R14  100.33,14.29 180 top
R15  153.19,20.32 0 top
R16  10.48,20.8 180 top
R17  17.3,56.04 0 top
R18  1.59,71.75 90 top
R19  97.95,21.75 0 top
R20  90.81,21.75 0 top
R21  83.82,21.75 0 top
R22  76.83,21.75 0 top
R23  69.85,21.75 0 top
R24  62.87,21.75 0 top
R25  55.88,21.75 0 top
R26  48.9,21.75 0 top
R28  145.1,94.14 180 top
R30  116.05,10.32 90 top
R33  146.53,21.75 180 top
R34  143.19,21.75 0 top
R45  145.1,96.68 180 top
RV1  79.69,38.89 270 top
RV2  93.03,38.89 270 top
RV3  66.83,38.89 270 top
RV4  53.82,38.89 270 top
S1  77.95,8.41 270 top
S2  84.93,8.41 270 top
S3  91.92,8.41 270 top
S4  98.9,8.41 270 top
S5  50.01,8.41 90 top
S6  56.99,8.41 90 top
S7  63.98,8.41 90 top
S8  70.96,8.41 90 top
U1  139.7,95.41 0 top
U2  107.16,9.21 90 top
U3  107,77.15 0 top
U$1  109.22,34.92 180 top
U$2  5.71,78.9 0 top
U$15  155.1,7.62 180 top
U$23  13.65,9.68 0 top
U$24  23.02,9.68 0 top
U$25  32.38,9.68 0 top
U$26  41.75,9.68 0 top
U$57  149.86,95.73 90 top
U$61  107.79,87.47 180 top
U$67  71.91,88.27 180 top
U$68  84.3,90.01 180 top
X3  153.19,75.72 90 top
XB1  15.56,65.09 90 top

### Tracks (layer width: path | path; a pad name or v marks a point on that pad's centre or on a via)
3.3V  (via drill 0.5, 0.6)
  Top 0.406: R15.1 152.43,19.08 v152.4,19.05 | R30.2 116.08,11.11 v117.32,11.11 | X3.SW3 130.45,62.07 128.11,62.07 127.03,63.15 R9.2 R8.2 127.03,74.93 | 127.03,74.93 127.03,75.41 | 127.03,75.41 R7.2 R6.2 R10.2 127.03,87.03 134.75,94.74 C5.2 U1.3 | X3.4 127.04,74.92 127.03,74.93 | U2.2 108.48,6.93 108.43,6.99 | C9.2 108.43,4.95 108.43,6.99 | U2.10 108.65,12.13 108.43,11.91 | 108.43,11.91 108.43,6.99 | 108.43,11.91 v106.84,11.91 | U3.2 104.72,75.04 105.09,75.41 110.01,75.41 | 110.01,75.41 111.28,75.41 | 111.28,75.41 127.03,75.41 | U3.10 109.92,75.31 110.01,75.41 | C10.2 111.28,75.41
  Top 0.61: R2.2 49.24,13.84 v49.21,13.81 47.94,13.81 46.83,14.92 46.83,19.05 45.4,20.48 | R5.2 70.2,13.84 v70.17,13.81 | R4.2 63.21,13.84 v63.18,13.81 | R3.2 56.23,13.84 v56.2,13.81 | R11.2 78.61,13.37 v78.11,12.86 | R12.2 85.6,13.37 v85.09,12.86 | R13.2 92.58,13.37 v92.08,12.86 | R14.2 99.57,13.37 v99.06,12.86 | X3.SW3 131.49,62.02 134.94,58.58 134.94,41.27 | 134.94,41.27 134.94,41.12 140.49,35.56 | U$2.P$16 40.96,76.04 28.51,76.04 XB1.1 6.56,36.94 7.3,36.2 18.57,36.2 23.97,30.8 28.73,30.8 32.07,27.46 32.07,21.75 33.34,20.48 45.4,20.48 | C12.P$1 134.75,41.08 134.94,41.27 | U$1.P$43 142.38,16.29 Q2.3 | 45.4,20.48 46.83,21.91 46.83,23.5 51.32,27.98 RV4.P$1 51.32,33.22 51.75,33.66 64.29,33.66 | 64.29,33.66 76.99,33.66 | 76.99,33.66 88.77,33.66 RV2.P$1 | RV3.P$1 64.33,33.62 64.29,33.66 | RV1.P$1 77.19,33.46 76.99,33.66
  Top 0.813: U$1.P$44 138.53,21.18 137.16,22.54 137.16,32.23 140.49,35.56 141.11,35.56 L1.2
  Bottom 0.406: v152.4,19.05 152.18,18.83 U$1.P$44 | v117.32,11.11 117.32,13.02 | v106.84,11.91 106.84,12.86 107,13.02
  Bottom 0.61: v49.21,13.81 v56.2,13.81 v63.18,13.81 v70.17,13.81 78.11,13.81 | 78.11,13.81 85.09,13.81 | 85.09,13.81 92.08,13.81 | 92.08,13.81 99.06,13.81 | 99.06,13.81 101.76,13.81 102.55,13.02 107,13.02 117.32,13.02 131.16,13.02 C3.+ 133.54,11.3 U$1.P$43 U$1.P$44 | v78.11,12.86 78.11,13.81 | v85.09,12.86 85.09,13.81 | v92.08,12.86 92.08,13.81 | v99.06,12.86 99.06,13.81 | XB1.1 7.71,55.24 13.4,55.24 XB1.5
5.0V  (via drill 0.6)
  Top 0.406: 11.27,20.77 12.86,20.77 C1.1 | 105.46,6.93 U2.19 103.14,6.93 v103.03,6.83 | 105.46,6.93 106.01,6.38 C6.1 | v46.83,7.78 45.72,8.89 v43.66,8.89 | U3.19 104.72,77.42 103.85,76.55 C8.1 102.87,58.1 114.62,46.35 114.62,23.97 105.73,15.08 105.73,7.2 105.46,6.93
  Top 0.61: MAX7221.VCC 11.11,20.92 R16.1 11.27,20.77 v11.27,19.37 | IC5.2 25.72,22.28 25.72,23.97 25.3,24.38 C17.2 v21.27,22.23
  Bottom 0.406: v103.03,6.83 102.71,6.83 101.76,7.78 74.77,7.78 73.5,6.51 73.5,4.13 72.71,3.33 49.21,3.33 48.1,4.45 48.1,6.51 v46.83,7.78 | v43.66,8.89 12.7,8.89 7.14,14.45 7.14,17.46 9.05,19.37 v11.27,19.37
  Bottom 0.61: v21.27,22.23 17.14,18.1 12.54,18.1 v11.27,19.37
12V  (via drill 0.6)
  Top 0.305: R33.1 150.11,21.75 150.27,21.91
  Top 0.61: IC5.3 28.1,22.32 28.1,23.81 28.51,24.23 C16.2 v30.16,20.8
  Top 0.813: C4.+ 129.7,2.54 PTC2.P$1 133.35,2.54 134.3,3.49 134.3,5.87 135.73,7.3 135.73,9.68 138.59,12.54 142.56,12.54 150.27,20.25 150.27,21.91 IC3.1
  Bottom 0.61: v30.16,20.8 44.45,20.8 46.67,18.57 46.67,13.97 45.72,13.02 45.72,6.35 46.67,5.4 46.67,2.22 47.15,1.75 122.56,1.75 C4.+
CAN_RX  (via drill 0.38)
  Top 0.305: U1.4 v138.75,93.5
  Bottom 0.305: v138.75,93.5 139.7,92.55 139.7,62.39 144.15,57.94 U$1.P$55
CAN_TX  (via drill 0.38)
  Top 0.305: U1.1 v138.75,97.31
  Bottom 0.305: v138.75,97.31 140.34,95.73 140.34,62.55 145.41,57.47 145.41,54.67 U$1.P$56
CANH
  Top 0.305: U1.7 143.19,96.04 143.83,96.68 R45.2 144.34,97.35 144.62,97.63 147.64,97.63 147.96,97.31 147.96,95.63 U$57.PIN1
CANL  (via drill 0.38)
  Top 0.305: U1.6 143.19,94.77 143.83,94.14 R28.2 144.34,93.47 144.62,93.19 147.8,93.19 147.96,93.34 v147.96,94.14
  Bottom 0.305: v147.96,94.14 147.96,94.82 U$57.PIN2
CTS-XBEE
  Bottom 0.305: XB1.12 22.56,71.61 5.56,54.61 5.56,53.5 6.03,53.02 7.78,53.02 8.1,52.7 8.1,33.5 8.73,32.86 15.72,32.86 25.72,22.86 44.13,22.86 48.58,18.41 110.01,18.41 112.08,20.48 116.55,20.48 U$1.P$28
DIG0  (via drill 0.5)
  Top 0.406: U$23.GND U$23.GND2 v13.65,19.37 | v14.13,29.69 16.19,31.75 MAX7221.DIG0
  Bottom 0.406: v13.65,19.37 13.65,29.21 v14.13,29.69
DIG1
  Top 0.406: U$24.GND U$24.GND2 23.02,18.89 22.7,19.21 19.21,19.21 18.41,20 18.41,24.92 15.72,27.62 5.56,27.62 4.76,28.42 MAX7221.DIG1
DIG2
  Top 0.406: U$25.GND U$25.GND2 32.38,18.73 31.91,19.21 23.5,19.21 22.86,19.84 19.53,19.84 19.05,20.32 19.05,25.24 16.03,28.26 12.38,28.26 11.11,29.53 MAX7221.DIG2
DIG3  (via drill 0.5)
  Top 0.406: U$26.GND U$26.GND2 41.75,19.05 41.43,19.37 32.7,19.37 32.23,19.84 23.81,19.84 23.18,20.48 19.84,20.48 19.68,20.64 19.68,25.56 16.35,28.89 12.54,28.89 12.06,29.37 v12.06,30.96 | v9.84,30.96 MAX7221.DIG3
  Bottom 0.406: v12.06,30.96 v9.84,30.96
GND  (via drill 0.5)
  other vias: 15.88,20.8 13.65,31.59 7.3,31.59 143.83,77.47 143.67,86.04 147.16,95.41 145.57,98.58
  pour Bottom: 0,100.33 160.02,100.33 160.02,0 0,0
  pour Top: 0,100.33 160.02,100.33 160.02,0 0,0
LED1
  Top 0.305: R19.2 97.92,22.54 91.44,22.54 90.96,23.02 84.77,23.02 84.3,23.5 83.03,23.5 82.87,23.65 JP1.1
  Bottom 0.305: U$1.P$3 106.36,43.5 106.36,42.55 105.41,41.59 105.41,40.64 104.46,39.69 104.46,38.73 103.19,37.47 103.19,26.19 102.87,25.88 83.66,25.88 JP1.1
LED2
  Top 0.305: R20.2 90.77,22.54 84.45,22.54 83.98,23.02 80.49,23.02 80.33,23.18 JP1.2
  Bottom 0.305: U$1.P$4 109.22,43.81 107.47,43.81 106.84,43.18 106.84,42.23 105.89,41.27 105.89,40.32 104.93,39.37 104.93,38.42 103.66,37.15 103.66,25.88 103.19,25.4 81.6,25.4 JP1.2
LED3
  Top 0.305: R21.2 83.79,22.54 78.11,22.54 77.79,22.86 JP1.3
  Bottom 0.305: U$1.P$5 106.36,40.96 106.36,40.01 105.41,39.05 105.41,38.1 104.14,36.83 104.14,25.56 103.5,24.92 79.53,24.92 JP1.3
LED4
  Top 0.305: R22.2 76.8,22.54 75.56,22.54 75.25,22.86 JP1.4
  Bottom 0.305: U$1.P$6 109.22,41.27 107.47,41.27 106.84,40.64 106.84,39.69 105.89,38.73 105.89,37.78 104.62,36.51 104.62,25.24 103.82,24.45 77.47,24.45 JP1.4
LED5
  Top 0.305: R23.2 72.39,21.75 72.71,22.07 JP1.5
  Bottom 0.305: U$1.P$7 106.36,38.42 106.36,37.47 105.09,36.2 105.09,24.92 104.14,23.97 75.41,23.97 JP1.5
LED6
  Top 0.305: R24.2 64.42,22.54 70.01,22.54 70.17,22.7 JP1.6
  Bottom 0.305: U$1.P$8 109.22,38.73 107.47,38.73 106.84,38.1 106.84,37.15 105.57,35.88 105.57,24.61 104.46,23.5 73.34,23.5 JP1.6
LED7
  Top 0.305: R25.2 57.44,22.54 63.66,22.54 64.14,23.02 67.47,23.02 67.63,23.18 JP1.7
  Bottom 0.305: U$1.P$9 106.05,35.56 106.05,24.29 104.78,23.02 71.28,23.02 JP1.7
LED8
  Top 0.305: R26.2 50.45,22.54 56.67,22.54 57.15,23.02 63.34,23.02 63.82,23.5 64.93,23.5 65.09,23.65 JP1.8
  Bottom 0.305: U$1.P$10 109.22,36.2 107.47,36.2 106.52,35.24 106.52,23.97 105.09,22.54 69.22,22.54 JP1.8
N$1
  Top 0.61: 136.5,2.12 PTC2.P$2
  Top 0.813: U$15.PWR2 136.5,2.12
N$2
  Top 0.305: R17.1 16.54,54.1 XB1.6
N$3
  Top 0.305: U3.17 106.02,86.54 104.79,87.77 U$61.PIN3
N$4
  Top 0.305: U3.16 106.67,86.51 107.79,87.63 U$61.PIN4
N$5
  Top 0.406: LED9.A 15.11,77.54 XB1.15
N$6
  Top 0.406: LED9.C R18.2
N$7
  Top 0.305: Q2.1 144.46,21.75 | 144.46,21.75 R34.2 | R33.2 144.46,21.75
N$8
  Top 0.305: U3.18 105.37,81.79 103.82,83.34 103.82,87.15 103.5,87.47 102.08,87.47 101.79,87.76 U$61.PIN2
N$9
  Top 0.305: U3.20 104.07,82.3 103.35,83.03 103.35,86.84 103.19,87 99.54,87 98.79,87.74 U$61.PIN1
N$10
  Top 0.305: U3.15 107.32,81.76 108.9,83.34 108.9,87 109.38,87.47 110.49,87.47 110.79,87.77 U$61.PIN5
N$11
  Top 0.305: U3.14 107.97,81.62 109.38,83.03 109.38,86.68 109.7,87 113.03,87 113.79,87.76 U$61.PIN6
N$18  (via drill 0.5)
  Top 0.406: 15.4,17.05 U$23.A 15.56,17.16 v15.56,12.7 | U$25.A 34.29,17.16 v34.29,12.7 | U$24.A 24.92,17.16 v24.92,12.7 | U$26.A 43.66,17.16 v43.66,12.7 | v12.86,12.7 8.57,12.7 6.67,14.61 6.67,19.68 4.76,21.59 MAX7221.SEG_A
  Bottom 0.406: v43.66,12.7 v34.29,12.7 v24.92,12.7 v15.56,12.7 v12.86,12.7
N$19
  Top 0.406: IC3.4 155.37,20.55 R1.2 R15.2
N$20
  Top 0.406: LED10.A R30.1
N$21
  Top 0.813: IC3.2 151.97,24.24 151.45,24.77 146.37,24.77 | 146.37,24.77 142.1,24.77 L1.1 | D2.C 145.1,40.96 146.37,39.69 146.37,24.77
N$23  (via drill 0.5)
  Top 0.406: U$23.B 17.46,17.13 v17.46,14.29 | U$26.B 45.56,17.13 v45.56,14.29 | U$25.B 36.2,17.13 v36.2,14.29 | U$24.B 26.83,17.13 v26.83,14.29 | v10.79,14.29 8.73,14.29 7.94,15.08 7.94,20.32 7.3,20.95 MAX7221.SEG_B
  Bottom 0.406: v45.56,14.29 v36.2,14.29 v26.83,14.29 v17.46,14.29 v10.79,14.29
N$24  (via drill 0.5)
  Top 0.406: U$23.C 15.56,2.21 v15.56,6.67 | U$26.C 43.66,2.21 v43.66,6.67 | U$24.C 24.92,2.21 v24.92,6.67 | U$25.C 34.29,2.21 v34.29,6.67 | MAX7221.SEG_C 12.38,24.77 12.06,25.08 3.02,25.08 2.7,24.77 2.7,17.94 v4.29,16.35
  Bottom 0.406: v43.66,6.67 v34.29,6.67 v24.92,6.67 v15.56,6.67 10.79,6.67 10.48,6.99 10.48,8.57 4.29,14.76 v4.29,16.35
N$25  (via drill 0.5)
  Top 0.406: U$23.D 11.75,2.21 v11.75,4.29 | U$26.D 39.85,2.21 v39.85,4.29 | U$24.D 21.11,2.21 v21.11,4.29 | U$25.D 30.48,2.21 v30.48,4.29 | MAX7221.SEG_D 16.19,24.61 13.81,26.99 2.54,26.99 0.79,25.24 0.79,15.56 v1.27,15.08
  Bottom 0.406: v39.85,4.29 v30.48,4.29 v21.11,4.29 v11.75,4.29 9.21,4.29 8.41,5.08 8.41,7.94 v1.27,15.08
N$26  (via drill 0.5)
  Top 0.406: U$23.E 9.84,2.23 v9.84,5.87 | U$26.E 37.94,2.23 v37.94,5.87 | U$24.E 19.21,2.23 v19.21,5.87 | U$25.E 28.57,2.23 v28.57,5.87 | MAX7221.SEG_E 13.65,24.61 12.54,25.72 2.86,25.72 2.06,24.92 2.06,17.14 v3.33,15.88
  Bottom 0.406: v37.94,5.87 v28.57,5.87 v19.21,5.87 v9.84,5.87 9.84,8.26 3.33,14.76 v3.33,15.88
N$27  (via drill 0.5)
  Top 0.406: U$23.F 11.75,17.16 v11.75,13.49 8.57,13.49 7.3,14.76 7.3,20 6.03,21.27 MAX7221.SEG_F | U$26.F 39.85,17.16 v39.85,13.49 | U$25.F 30.48,17.16 v30.48,13.49 | U$24.F 21.11,17.16 v21.11,13.49
  Bottom 0.406: v11.75,13.49 v21.11,13.49 v30.48,13.49 v39.85,13.49
N$28  (via drill 0.5)
  Top 0.406: U$23.G 9.84,17.13 v9.84,15.08 8.89,15.08 8.57,15.4 MAX7221.SEG_G | U$24.G 19.21,17.13 v19.21,15.08 | U$25.G 28.57,17.13 v28.57,15.08 | U$26.G 37.94,17.13 v37.94,15.08
  Bottom 0.406: v9.84,15.08 v19.21,15.08 v28.57,15.08 v37.94,15.08
N$30
  Top 0.305: R19.1 97.15,21.75 LED1.A
N$32
  Top 0.305: R20.1 90.17,21.75 LED2.A
N$34
  Top 0.305: R21.1 83.18,21.75 LED3.A
N$36
  Top 0.305: R22.1 76.2,21.75 LED4.A
N$38
  Top 0.305: R23.1 69.21,21.75 LED5.A
N$40
  Top 0.305: R24.1 62.23,21.75 LED6.A
N$42
  Top 0.305: R25.1 55.24,21.75 LED7.A
N$44
  Top 0.305: R26.1 48.26,21.75 LED8.A
N$54  (via drill 0.5)
  Top 0.406: U$23.DP 17.46,2.23 v17.46,5.08 | U$26.DP 45.56,2.23 v45.56,5.08 | U$24.DP 26.83,2.23 v26.83,5.08 | U$25.DP 36.2,2.23 v36.2,5.08 | MAX7221.SEG_DP 14.92,24.92 13.49,26.35 2.7,26.35 1.43,25.08 1.43,16.51 v2.22,15.72
  Bottom 0.406: v45.56,5.08 v36.2,5.08 v26.83,5.08 v17.46,5.08 9.37,5.08 9.05,5.4 9.05,8.26 2.22,15.08 v2.22,15.72
N$55
  Top 0.406: MAX7221.ISET 9.84,20.92 R16.2
N$56  (via drill 0.38)
  Top 0.305: U2.18 103.38,7.58 103.35,7.62 103.03,7.62 v102.71,7.94 | v46.83,9.05 45.88,10 v43.66,10 | v12.06,10.64 9.05,10.64 5.08,14.61 5.08,16.67 3.49,18.26 MAX7221.CLK
  Bottom 0.305: v102.71,7.94 102.23,8.41 74.61,8.41 72.87,6.67 72.87,4.29 72.55,3.97 49.37,3.97 48.74,4.6 48.74,6.99 47.62,8.1 47.62,8.26 v46.83,9.05 | v43.66,10 43.5,10 43.02,9.53 12.86,9.53 12.06,10.32 v12.06,10.64
N$57  (via drill 0.38)
  Top 0.305: U2.17 103.37,8.23 v102.71,8.89 | v47.94,9.21 46.2,10.95 v43.66,10.95 | v11.43,11.43 9.05,11.43 5.87,14.61 5.87,18.1 v4.92,19.05 | v3.49,31.91 MAX7221.LOAD
  Bottom 0.305: v102.71,8.89 74.3,8.89 72.39,6.99 72.39,4.6 72.23,4.45 52.39,4.45 51.59,5.24 51.59,6.19 50.64,7.14 49.37,7.14 48.26,8.26 48.26,8.89 v47.94,9.21 | v43.66,10.95 42.7,10 13.18,10 12.86,10.32 12.86,10.95 12.38,11.43 v11.43,11.43 | v4.92,19.05 3.49,20.48 v3.49,31.91
N$58  (via drill 0.38)
  Top 0.305: U2.20 103.6,6.28 v103.03,5.71 | v43.66,7.78 45.56,7.78 v46.67,6.67 | v14.92,7.94 v14.92,11.27 | v17.46,28.89 MAX7221.DIN
  Bottom 0.305: v103.03,5.71 101.6,7.14 74.93,7.14 74.14,6.35 74.14,3.97 72.87,2.7 49.05,2.7 47.47,4.29 47.47,5.87 v46.67,6.67 | v43.66,7.78 43.34,7.78 42.86,8.26 15.24,8.26 v14.92,7.94 | v14.92,11.27 14.29,11.91 12.06,11.91 11.75,12.22 11.27,12.22 8.41,15.08 8.41,16.35 9.05,16.99 18.26,16.99 22.23,20.95 22.23,23.02 17.46,27.78 v17.46,28.89
N$72
  Top 0.305: U1.5 141.45,93.5 140.81,94.14 140.81,95.25 140.97,95.41 C7.2 144.46,95.41 | 144.46,95.41 145.73,96.68 R45.1 | 144.46,95.41 145.73,94.14 R28.1
RTS-XBEE
  Bottom 0.305: XB1.16 14.56,64.41 5.08,54.93 5.08,53.18 5.71,52.55 7.46,52.55 7.62,52.39 7.62,33.18 8.41,32.38 15.4,32.38 25.4,22.38 43.81,22.38 48.26,17.94 110.33,17.94 112.39,20 116.2,20 117,19.21 117,17.49 U$1.P$27
SD_IN
  Top 0.305: X3.SW1 143.88,63.82 U$1.P$49
SDIO_CK  (via drill 0.38)
  Top 0.305: 147.9,72.39 X3.5 arc90 147.9,72.39 | v150.97,72.39 147.9,72.39
  Bottom 0.305: U$1.P$47 155.1,56.74 155.1,70.96 153.67,72.39 v150.97,72.39
SDIO_CMD
  Top 0.305: R7.1 128.64,79.92 X3.2 152.17,79.92 154.62,77.47 154.62,68.58 150.34,64.29 150.34,60.33 153.03,57.63 153.03,54.67 U$1.P$48
SDIO_D0  (via drill 0.38)
  Top 0.305: R8.1 128.6,67.42 X3.7 147.98,67.31 v150.65,67.31
  Bottom 0.305: U$1.P$37 132.24,17.62 132.24,37.15 139.22,44.13 145.89,44.13 153.03,51.28 153.03,60.8 150.65,63.18 v150.65,67.31
SDIO_D1  (via drill 0.38)
  Top 0.305: R9.1 128.64,65.8 X3.8 147.96,65.71 v147.96,64.29
  Bottom 0.305: U$1.P$38 130.91,36.61 138.91,44.61 145.57,44.61 150.5,49.53 150.5,61.75 v147.96,64.29
SDIO_D2  (via drill 0.38)
  Top 0.305: R10.1 X3.9 v150.97,84.93
  Bottom 0.305: U$1.P$45 156.84,83.5 155.42,84.93 v150.97,84.93
SDIO_D3  (via drill 0.38)
  Top 0.305: R6.1 128.59,82.42 X3.1 147.9,82.39 v150.97,82.39
  Bottom 0.305: U$1.P$46 155.57,54.67 155.57,81.44 154.62,82.39 v150.97,82.39
SPI_LOAD
  Top 0.305: U2.4 112.58,8.23 114.62,6.19 117,6.19 124.94,14.13 130.81,14.13 132.24,15.56 132.24,17.62 U$1.P$40
SPI_MOSI  (via drill 0.38)
  Top 0.305: U2.1 111.38,6.28 v111.44,6.35 | v112.24,11.43 112.24,15.4 111.92,15.72 111.92,16.83 112.71,17.62 114.46,17.62 U$1.P$26
  Bottom 0.305: v111.44,6.35 112.24,7.14 v112.24,11.43
SPI_SCK  (via drill 0.38)
  Top 0.305: U2.3 111.32,7.58 v111.44,7.46 | v111.44,12.06 111.44,17.14 U$1.P$24
  Bottom 0.305: v111.44,7.46 v111.44,12.06
SS-XBEE
  Top 0.305: C2.2 R17.2
SW1
  Top 0.305: S5.S 50.77,11.72 R2.1 54.93,15.24 55.72,16.03 61.91,16.03 62.39,16.51 68.58,16.51 69.06,16.99 90.01,16.99 90.49,17.46 96.68,17.46 97.16,17.94 101.28,17.94 102.55,19.21 102.55,26.67 104.46,28.57 104.46,29.53 105.41,30.48 105.41,31.43 106.36,32.38 106.36,33.34 U$1.P$11
SW2
  Top 0.305: S6.S 57.75,11.72 R3.1 61.91,15.24 62.71,16.03 68.9,16.03 69.37,16.51 90.33,16.51 90.81,16.99 97,16.99 97.47,17.46 101.6,17.46 103.03,18.89 103.03,26.35 104.93,28.26 104.93,29.21 105.89,30.16 105.89,31.11 106.84,32.07 106.84,33.02 107.47,33.66 109.22,33.66 U$1.P$12
SW3
  Top 0.305: S7.S 64.74,11.72 R4.1 68.9,15.24 69.69,16.03 90.65,16.03 91.12,16.51 97.31,16.51 97.79,16.99 101.92,16.99 103.5,18.57 103.5,26.04 105.41,27.94 105.41,28.89 106.36,29.84 106.36,30.8 U$1.P$13
SW4
  Top 0.305: S8.S 71.72,11.72 R5.1 84.45,15.24 84.77,15.56 90.96,15.56 91.44,16.03 97.63,16.03 98.11,16.51 102.23,16.51 103.98,18.26 103.98,25.72 105.89,27.62 105.89,28.57 106.84,29.53 106.84,30.48 107.47,31.11 109.22,31.11 U$1.P$14
SW5
  Top 0.305: S1.2 S1.1 80.21,14.22 R11.1 84.3,14.29 85.09,15.08 91.28,15.08 91.76,15.56 97.95,15.56 98.42,16.03 102.55,16.03 104.46,17.94 104.46,25.4 106.36,27.3 106.36,28.26 U$1.P$15
SW6
  Top 0.305: S2.2 S2.1 87.19,14.22 R12.1 91.28,14.29 92.08,15.08 98.27,15.08 98.74,15.56 102.87,15.56 104.93,17.62 104.93,25.08 106.84,26.99 106.84,27.94 107.47,28.57 109.22,28.57 U$1.P$16
SW7
  Top 0.305: S3.2 S3.1 94.18,14.22 R13.1 98.27,14.29 99.06,15.08 103.19,15.08 105.41,17.3 105.41,24.77 U$1.P$17
SW8
  Top 0.305: S4.2 S4.1 101.16,14.22 R14.1 103.19,14.29 105.89,16.99 105.89,24.45 107.47,26.04 109.22,26.04 U$1.P$18
USART1_RX
  Top 0.305: XB1.2 8.56,55.07 28.89,75.41 42.86,75.41 U$2.P$17
  Bottom 0.305: XB1.2 8.56,33.83 9.05,33.34 16.03,33.34 26.04,23.34 44.45,23.34 48.9,18.89 109.7,18.89 110.49,19.68 U$1.P$22
USART1_TX
  Top 0.305: XB1.3 10.56,56.28 29.21,74.93 44.93,74.93 U$2.P$18
  Bottom 0.305: U$1.P$21 107.95,19.68 107.63,19.37 49.21,19.37 44.77,23.81 26.35,23.81 16.35,33.81 9.37,33.81 9.05,34.13 9.05,52.58 XB1.3
V-SENSE
  Top 0.305: U$1.P$39 134.78,17.62 139.38,17.62 141.18,19.41 Q2.2

### Text on the board
Top: CAN2
tSilk: I2C | SPI | H-Bridge
_tsilk: PA8 | PB12 | PA3 | PE7 | PB1 | PB0 | PC5 | PC4 | PWR | PE8 | PE9 | PE10 | PE11 | PE12 | PE13 | PE14 | PE15